# Altium schematic sheet QSPI_NOR.SchDoc: QSPI_NOR
size A4; Date: Not used; ApprovedBy: Not used; CheckedBy: Not used; Author: Not used; CompanyName: STMicroelectronics; DrawnBy: Not used; Engineer: Not used; Organization: Not used; Address1: Not used; Address2: Not used; Address3: Not used; Address4: Not used; DocumentNumber: Not used; Revision: Not used; SheetNumber: 14; SheetTotal: 18; CurrentTime: Not used; CurrentDate: Not used; Time: Not used; DocumentFullPathAndName: Not used; DocumentName: Not used; ModifiedDate: Not used; ImagePath: Not used; ProjectName: Not used; Application_BuildNumber: Not used
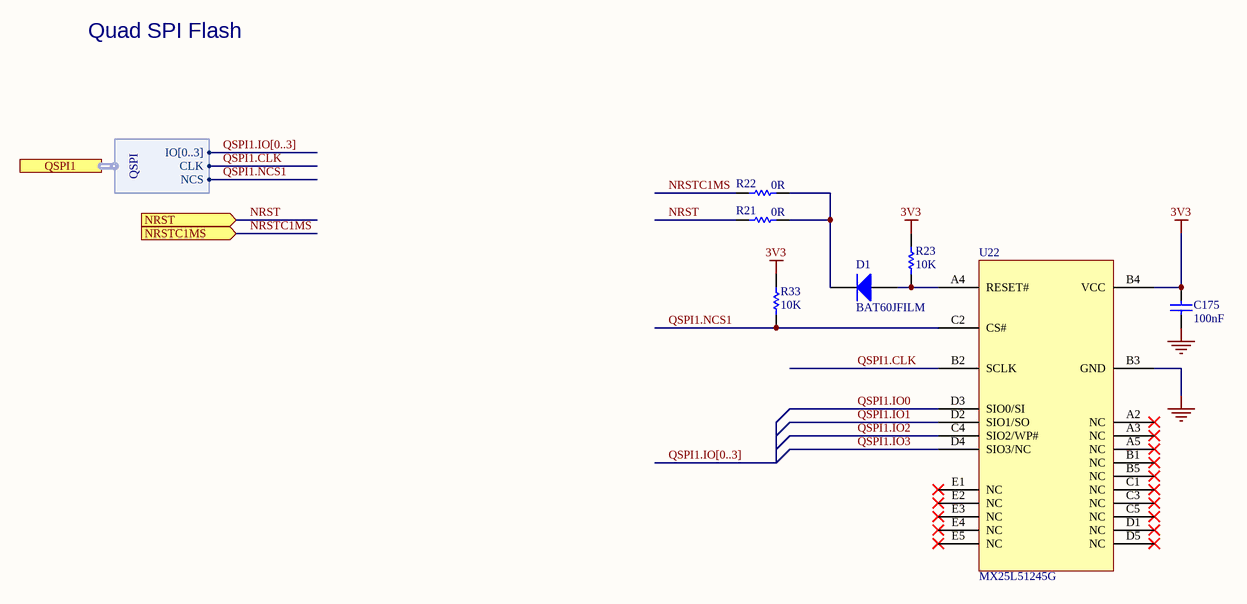
[diagram p0: QSPI_NOR.SchDoc]

## Parts
C175  value 100nF  [C0402]  (hidden comment: Capacitor)
D1  BAT60JFILM  [DIO_SOD323]
R21  value 0R  [R0402]  (hidden comment: Resistor)
R22  value 0R  [R0402]  (hidden comment: Resistor)
R23  value 10K  [R0402]  (hidden comment: Resistor)
R33  value 10K  [R0402]  (hidden comment: Resistor)
U22  MX25L51245G  [ICC_BGA24_5X5-BALL-ARRAY_6X8_P1]

## Ports
NRST (in), NRSTC1MS (in), QSPI1 (harness QSPI)

## Harnesses
QSPI: IO[0..3], CLK, NCS

## Nets
3V3: C175.2 R23.2 R33.2 U22.B4(VCC)
GND: C175.1 U22.B3(GND)
NRST: R21.1 ; port NRST
NRSTC1MS: R22.1 ; port NRSTC1MS
QSPI1.CLK: U22.B2(SCLK) ; port QSPI1.CLK
QSPI1.IO0: U22.D3(SIO0/SI)
QSPI1.IO1: U22.D2(SIO1/SO)
QSPI1.IO2: U22.C4(SIO2/WP#)
QSPI1.IO3: U22.D4(SIO3/NC)
QSPI1.NCS1: R33.1 U22.C2(CS#) ; port QSPI1.NCS
NetD1_1: D1.1(A) R23.1 U22.A4(RESET#)
NetD1_2: D1.2(K) R21.2 R22.2

Not connected (* = marked no-connect by the designer): U22 A2(NC)* A3(NC)* A5(NC)* B1(NC)* B5(NC)* C1(NC)* C3(NC)* C5(NC)* D1(NC)* D5(NC)* E1(NC)* E2(NC)* E3(NC)* E4(NC)* E5(NC)*

## Buses and harness runs
bus QSPI1.IO[0..3]

## Notes on the sheet
- Quad SPI Flash
- Title:
- Project:
- Size:
- Revision:
- Variant:
- A4
- -
- Date:
- Reference:
- Sheet:
- of

## Library data of the parts
C175 = MCD-00006: Capacitor, MLCC, 100nF, 16V, X7R, +/-10%, 0402, T=0.5mm; Part_Preference: Recommended; Manufacturer: YAGEO; Manufacturer_Part_Number: CC0402KRX7R7BB104; Order_Code_RS: 616-9701; Component_Country_Of_Origin: China; ShowFields: YES; ID: 2474; Internal_Part_Number: MCD-00006; Status: Released; Part_Type: Capacitor; Package: 0402; ComponentLink1URL: http://tunmcdsvn.tun.st.com/Component_Documentation_Library/Trunk/Capacitor/YAGEO_X7R_Series; Order_Code_Digikey: 311-1338-1-ND; Order_Code_Farnell: 9402047
D1 = MCD-00034: BMS_Part_Number: 9151097; Part_Type: Diode; Part_Preference: Recommended; Manufacturer: STMICROELECTRONICS; Manufacturer_HQ_COO: EU; Component_Country_Of_Origin: China; ShowFields: YES; ID: 2483; Internal_Part_Number: MCD-00034; Value: BAT60JFILM; Status: Released; Manufacturer_Part_Number: BAT60JFILM; ComponentLink1URL: http://tunmcdsvn.tun.st.com/Component_Datasheet_Library/Trunk/Diodes/STM_Diode_BAT60JFILM-SOD323
R21 R22 = MCD-00052: Resistor,0R,0402,5%,1/16W; Manufacturer_Part_Number: RC0402JR-070RL; Manufacturer: YAGEO; Part_Preference: Recommended; Order_Code_RS: 618-5804; Component_Country_Of_Origin: China; ID: 2540; ShowFields: YES; Internal_Part_Number: MCD-00052; Status: Released; Part_Type: Resistor; ComponentLink1Description: Datasheet; ComponentLink1URL: http://tunmcdsvn.tun.st.com/Component_Documentation_Library/Trunk/Resistor/YAGEO_RC_L_Series; Package: 0402; Order_Code_Digikey: 311-0.0JRCT-ND; Order_Code_Farnell: 9232516RL; Alternate_Manufacturer: N/A; Alternate_Manufacturer_Part_Number: N/A
R23 R33 = MCD-00053: Resistor,10K,0402,1%,1/16W; Manufacturer_Part_Number: RC0402FR-0710KL; Manufacturer: YAGEO; BMS_Part_Number: 9131590; ECCN_US: EAR99; ECCN_EU: NEC; Provided_By: SUBCO; Internal_Part_Number: MCD-00053; Status: Released; Part_Type: Resistor; Package: R0402; ComponentLink1Description: Datasheet; ComponentLink1URL: http://tunmcdsvn.tun.st.com/Component_Datasheet_Library/Trunk/Resistors/Yageo_Resistor_RC0402-series
U22 = MCD-00114: Memory,Serial-NOR,512Mb,3V; Part_Type: IC; Manufacturer: MACRONIX; ECCN_US: tbd; Provided_By: SUBCO; Internal_Part_Number: MCD-00114; Value: MX25L51245G; Status: Released; Manufacturer_Part_Number: MX25L51245G; ComponentLink1Description: Datasheet; ComponentLink1URL: http://tunmcdsvn.tun.st.com/Component_Datasheet_Library/Trunk/IC/Macronix_SerialNOR_MX25L51245Gver13; ECCN_EU: tbd